# Altium schematic sheet 5kHz_GEN_LPF.SchDoc: 5kHz Sine Gen LPF
size A4; Organization: Altium Limited; Address1: L3, 12a Rodborough Rd; Address2: Frenchs Forest; Address3: NSW; Address4: Australia 2086
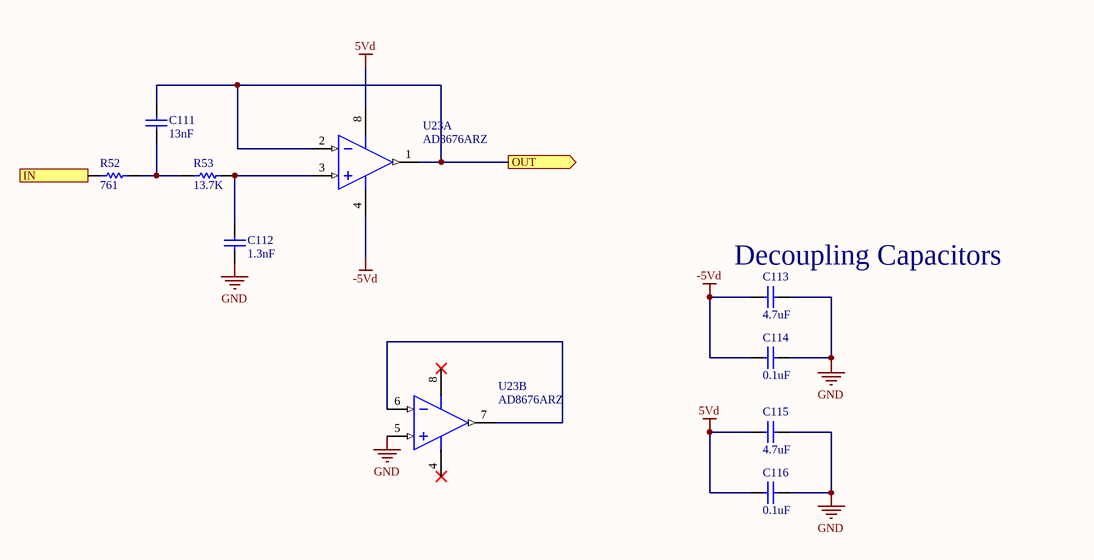
[diagram p0: 5kHz_GEN_LPF.SchDoc]

## Parts
C111  13nF  [0402_Cap]
C112  1.3nF  [0402_Cap]
C113  4.7uF  [0402_Cap]
C114  0.1uF  [0402_Cap]
C115  4.7uF  [0402_Cap]
C116  0.1uF  [0402_Cap]
R52  761  [0402_Res]
R53  13.7K  [0402_Res]
U23  AD8676ARZ  [ADI-R-8_M]  (parts A,B of 2)

## Ports
IN (in), OUT (out)

## Nets
5Vd: C115.1 C116.1 U23.8(+V)
-5Vd: C113.1 C114.1 U23.4(-V)
GND: C112.1 C113.2 C114.2 C115.2 C116.2 U23.5(+IN_B)
IN: R52.1 ; port IN
OUT: C111.2 U23.1(OUT_A) U23.2(-IN_A) ; port OUT
NetC111_1: C111.1 R52.2 R53.1
NetC112_2: C112.2 R53.2 U23.3(+IN_A)
NetU23_6: U23.6(-IN_B) U23.7(OUT_B)

## Notes on the sheet
- (near C113) Decoupling Capacitors
- Title
- Date:
- RE:
- Arturo di Girolamo
- Size:
- A3
- A

## Library data of the parts
C111 = 08051C163JAT2A: Capacitor, 16nF, 0805, 25V; ASYPN: C0402C123K8PACTU; Value: 16nF; MFGPN: 08051C163JAT2A
C112 = GRM2165C2A162JA01D: Capacitor, 1.6nF, 0805, 25V; ASYPN: GRM1557U1A122JA01D; Value: 1.6nF; MFGPN: GRM2165C2A162JA01D
C113 C115 = CL21A475KAQNNNE: Capacitor, 4.7uF, 0805; Value: .01uf; ASYPN: GRM155R61A475MEAAD; MFGPN: CL21A475KAQNNNE
C114 C116 = CL21B104KACNNNC: Capacitor, 0.1uF, 0805; Value: .01uf; ASYPN: 0402YC104KAT2A; MFGPN: CL21B104KACNNNC
R52 = RC0805FR-071K65L: 1.65k; ASYPN: ERA-2AEB7680X; Value: 1.65k; MFGPN: RC0805FR-071K65L
R53 = RC0805FR-075K9L: 5.9k; ASYPN: RMCF0402FT13K7; Value: 5.9k; MFGPN: RC0805FR-075K9L
U23 = CMP-0384-01145-2: Double Channel Wide Bandwidth Operational Amplifier, 10 MHz BW, 2.5 V/us SR, Industrial, 8-pin SOIC (R-8), Tube; Generic Part Number: AD8676; Manufacturer: Analog Devices; Input Offset Voltage: 12uV; Input Bias Current: 2.4nA; V Span Min: 10V; Iq/Amp: 2.7mA; V Span Max: 36V; Small Signal Bandwidth: 10MHz; Amplifiers Per Package: 2; Code_JEDEC: MS-012-AA; Mounting Technology: Surface Mount; Slew Rate: 2.5V/us; DatasheetVersion: Rev. C; ComponentLink2Description: Datasheet; ComponentLink3Description: Package Specification; PackageReference: R-8; ComponentLink1URL: http://www.analog.com/en/index.html; RevisionNote: Reference Circuit URL fixed; ComponentLink1Description: Manufacturer URL; ComponentLink2URL: http://www.analog.com/static/imported-files/data_sheets/AD8676.pdf; ComponentLink3URL: http://www.analog.com/static/imported-files/packages/PKG_PDF/SOIC_Narrow%20(R)/R_8.pdf; ComponentLink4Description: Reference Circuit; ComponentLink4URL: http://www.analog.com/en/all-operational-amplifiers-op-amps/operational-amplifiers-op-amps/ad8676/products/product.html#product-recommendations; PackageDescription: 8-Pin Standard Small Outline Package, Body 3.9 x 4.9 mm, Pitch 1.27 mm; PartNumber: AD8676ARZ; PackageVersion: 060506-A; ASYPN: AD8676ARZ